# EAGLE design battery_powered_sensor (EAGLE 9.6.2)
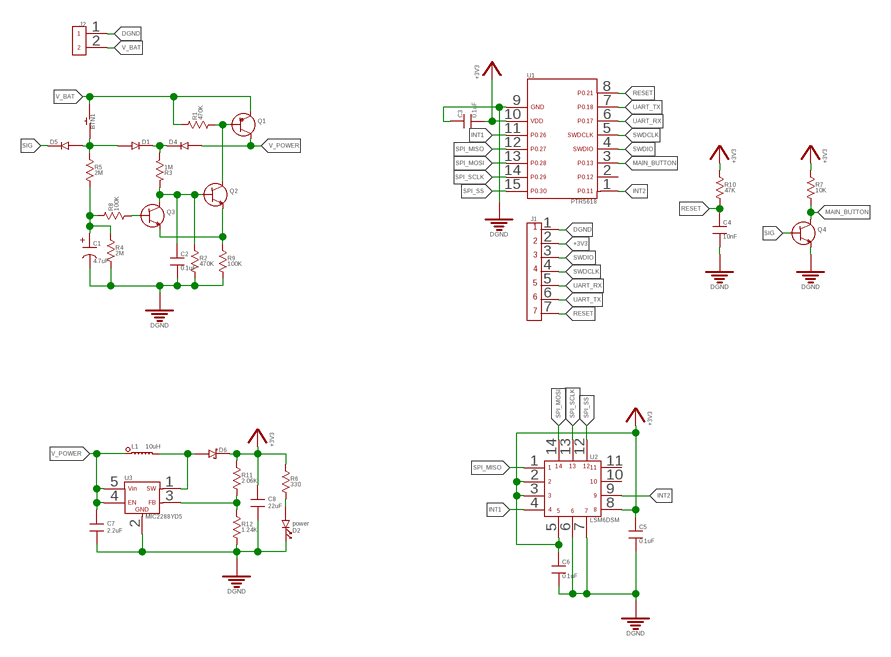
[diagram p0: schematic, sheet 1]

## Parts
BTN1  BTN_NORMAL_OFF_6_3.5_SMD  [BTN_6_3.5_SMD]
C1  4.7uF  CAPACITOR_POLARIZED_530_530  [CAP_530_530]
C2  0.1uF  CAPACITOR_FIXED_0805  [0805]
C3  0.1uF  CAPACITOR_FIXED_0805  [0805]
C4  10nF  CAPACITOR_FIXED_0805  [0805]
C5  0.1uF  CAPACITOR_FIXED_0805  [0805]
C6  0.1uF  CAPACITOR_FIXED_0805  [0805]
C7  2.2uF  CAPACITOR_FIXED_0805  [0805]
C8  22uF  CAPACITOR_FIXED_0805  [0805]
D1  DIODE0805  [0805DIODE]
D2  power  LED-0805  [0805DIODE]
D4  DIODE0805  [0805DIODE]
D5  DIODE0805  [0805DIODE]
D6  SCHOTTKY_DIODE_0805  [0805DIODE]
J1  7PIN_HEADER_PITCH2.54MM_TH  [7PIN_HEADER_PITCH2.54MM_TH]
J2  2PIN_HEADER_PITCH2.54MM_TH  [2PIN_HEADER_PITCH2.54MM_TH]
L1  10uH  INDUCTOR_1008  [1008]
Q1  MMBT4403  [SOT_23_3]
Q2  BC846  [SOT_23_3]
Q3  BC846  [SOT_23_3]
Q4  BC846  [SOT_23_3]
R1  470K  RESISTOR_0805  [0805]
R2  470K  RESISTOR_0805  [0805]
R3  1M  RESISTOR_0805  [0805]
R4  2M  RESISTOR_0805  [0805]
R5  2M  RESISTOR_0805  [0805]
R6  330  RESISTOR_0805  [0805]
R7  10K  RESISTOR_0805  [0805]
R8  100K  RESISTOR_0805  [0805]
R9  100K  RESISTOR_0805  [0805]
R10  47K  RESISTOR_0805  [0805]
R11  2.06K  RESISTOR_0805  [0805]
R12  1.24K  RESISTOR_0805  [0805]
U1  PTR5618  [PTR5618]
U2  LSM6DSM  [LGA-14L]
U3  MIC2288YD5  [SOT-23-5]

## Nets
+3V3: C3.2 C5.1 C6.1 C8.1 D6.1 J1.2 R6.1 R7.1 R10.1 R11.1 U1.10 U2.2 U2.3 U2.5 U2.8
DGND: C1.2 C2.2 C3.1 C4.2 C5.2 C6.2 C7.2 C8.2 D2.1(K) J1.1 J2.1 Q4.3(E) R2.2 R4.2 R9.2 R12.2 U1.9 U2.6 U2.7 U3.2(GND)
INT1: U1.11 U2.4
INT2: U1.1 U2.9
MAIN_BUTTON: Q4.2(C) R7.2 U1.3
N$1: D1.1 D4.1 R3.2
N$2: Q1.1(B) Q2.2(C) R1.2
N$3: Q2.3(E) Q3.3(E) R9.1
N$4: C2.1 Q2.1(B) Q3.2(C) R2.1 R3.1
N$5: D2.2(A) R6.2
N$6: C1.1 R4.1 R5.2 R8.1
N$9: Q3.1(B) R8.2
N$10: BTN1.1 D1.2 D5.2 R5.1
N$14: R11.2 R12.1 U3.3(FB)
N$28: D6.2 L1.2 U3.1(SW)
RESET: C4.1 J1.7 R10.2 U1.8
SIG: D5.1 Q4.1(B)
SPI_MISO: U1.12 U2.1
SPI_MOSI: U1.13 U2.14
SPI_SCLK: U1.14 U2.13
SPI_SS: U1.15 U2.12
SWDCLK: J1.4 U1.5
SWDIO: J1.3 U1.4
UART_RX: J1.5 U1.6
UART_TX: J1.6 U1.7
V_BAT: BTN1.2 J2.2 Q1.3(E) R1.1
V_POWER: C7.1 D4.2 L1.1 Q1.2(C) U3.4(EN) U3.5(VIN)
Unconnected: U1.2 U2.10 U2.11

## Library data of the parts
BTN1 = Switches:BTN_NORMAL_OFF
C1 = Capacitors:CAPACITOR_POLARIZED
C2-C8 = Capacitors:CAPACITOR_FIXED
D1 D4 D5 = Diodes:DIODE
D2 = LEDs:LED
D6 = Diodes:SCHOTTKY_DIODE
J1 = Connectors:7PIN
J2 = Connectors:2PIN
L1 = Inductors:INDUCTOR
Q1 = BJTs:MMBT4403
Q2-Q4 = BJTs:BC846
R1-R12 = Resistors:RESISTOR
U1 = MCUs:PTR5618
U2 = IMU:LSM6DSM
U3 = Power Supplies:MIC2288YD5

## Board
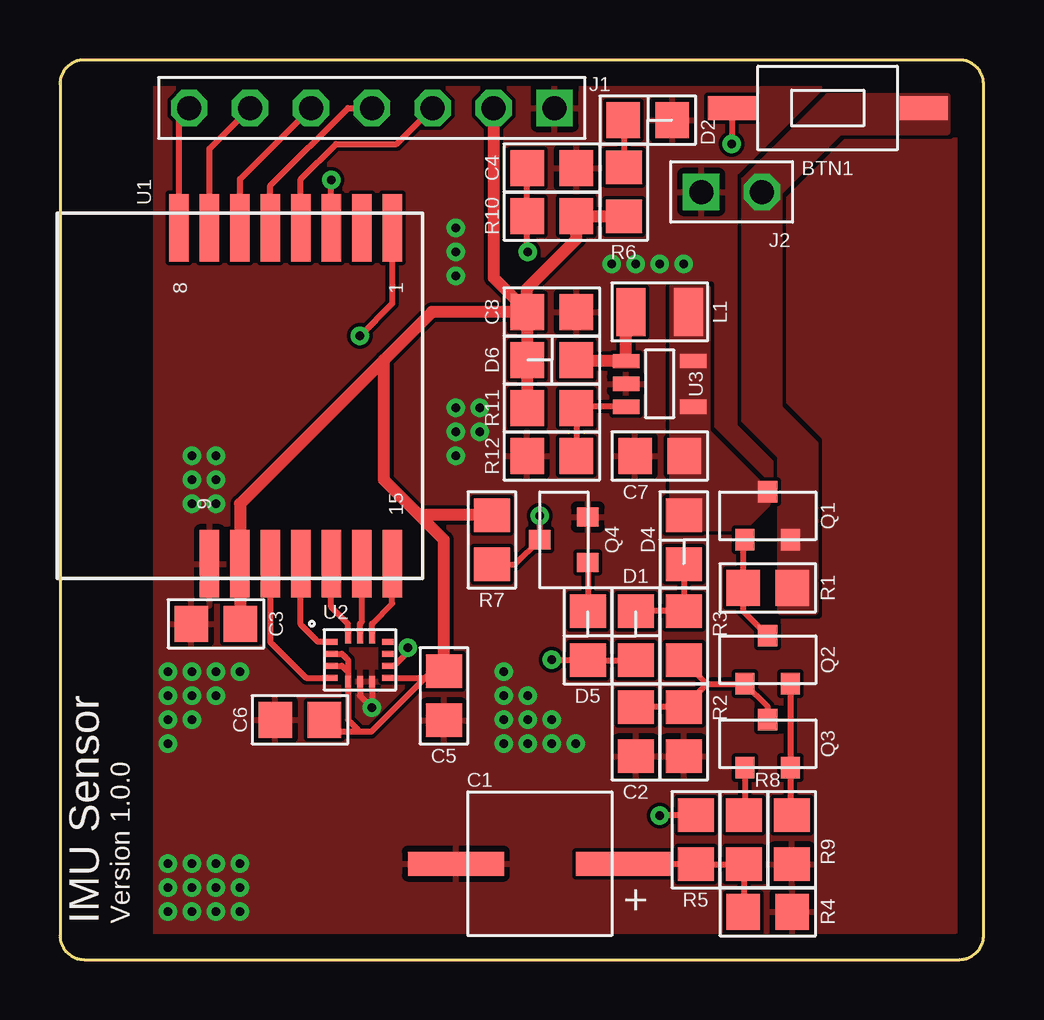
[diagram p1: board, top side]
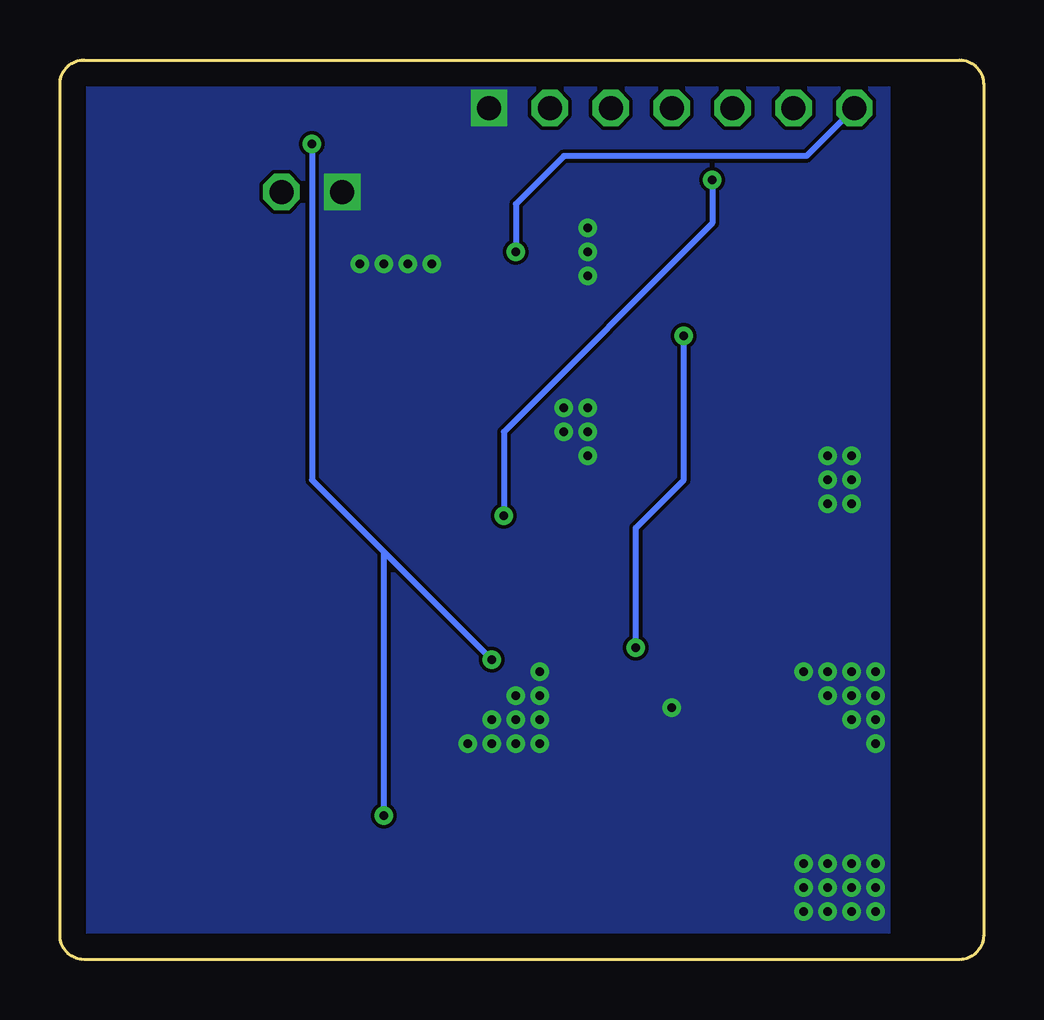
[diagram p2: board, bottom side, seen from below]

Size 38.5 x 37.5 mm. Coordinates in mm from the lower left corner, seen from the top.
Outline: 0,36.5 0,1 arc90 1,0 37.5,0 arc90 38.5,1 38.5,36.5 arc90 37.5,37.5 1,37.5 arc90 0,36.5
Copper layers (1*16): Top 0.035mm / dielectric 1.5mm / Bottom 0.035mm
Design rules "default *": minimum track width 6mil, minimum drill 0.35mm, track to track 6mil, track to pad 6mil, pad to pad 6mil, via to via 6mil, smd to smd 6mil, copper to edge 40mil, drill to drill 6mil, minimum pad ring 10mil, minimum via ring 8mil, stop-mask expansion 4mil, vias tented up to drill 20mil, thermal gap 10mil

### Footprints (pad centres in the part's own frame; a part is rotated, then mirrored left to right if it is on the bottom)
BTN_6_3.5_SMD = smd 1 x 2: 1 0,4; 2 0,-4
CAP_530_530 = smd 4 x 1: 1 -3.5,0; 2 3.5,0
0805 = smd 1.4 x 1.5: 1 -1.025,0; 2 1.025,0
0805DIODE = smd 1.4 x 1.5: 1 -1.025,0; 2 1.025,0
7PIN_HEADER_PITCH2.54MM_TH = drill 1 square: 1 -7.62,0 | drill 1 octagon: 2 -5.08,0; 3 -2.54,0; 4 0,0; 5 2.54,0; 6 5.08,0; 7 7.62,0
2PIN_HEADER_PITCH2.54MM_TH = drill 1 square: 1 -1.27,0 | drill 1 octagon: 2 1.27,0
1008 = smd 1.2 x 2: 1 -1.2,0; 2 1.2,0
SOT_23_3 = smd 0.8 x 0.9: 1 -0.95,0; 2 0,2; 3 0.95,0
PTR5618 = smd 2.794 x 0.813: 1 7,-6.35; 2 7,-5.08; 3 7,-3.81; 4 7,-2.54; 5 7,-1.27; 6 7,0; 7 7,1.27; 8 7,2.54; 9 -7,1.27; 10 -7,0; 11 -7,-1.27; 12 -7,-2.54; 13 -7,-3.81; 14 -7,-5.08; 15 -7,-6.35
LGA-14L = smd 0.475 x 0.25: 1 -1.163,0.75; 2 -1.163,0.25; 3 -1.163,-0.25; 4 -1.163,-0.75; 8 1.163,-0.75; 9 1.163,-0.25; 10 1.163,0.25; 11 1.163,0.75 | smd 0.25 x 0.475: 5 -0.5,-0.912; 6 0,-0.912; 7 0.5,-0.912; 12 0.5,0.912; 13 0,0.912; 14 -0.5,0.912
SOT-23-5 = smd 0.6 x 1.1: 1 -0.95,-1.4; 2 0,-1.4; 3 0.95,-1.4; 4 0.95,1.4; 5 -0.95,1.4

### Placement (x,y rotation side)
BTN1  32,35.5 90 top
C1  20,4 180 top
C2  24,9.5 270 top
C3  6.5,14 0 top
C4  20.5,33 0 top
C5  16,11 270 top
C6  10,10 180 top
C7  25,21 180 top
C8  20.5,27 0 top
D1  24,13.5 270 top
D2  24.5,35 180 top
D4  26,17.5 90 top
D5  22,13.5 270 top
D6  20.5,25 0 top
J1  13,35.5 180 top
J2  28,32 0 top
L1  25,27 180 top
Q1  29.5,17.5 0 top
Q2  29.5,11.5 0 top
Q3  29.5,8 0 top
Q4  22,17.5 90 top
R1  29.5,15.5 180 top
R2  26,9.5 270 top
R3  26,13.5 90 top
R4  29.5,2 0 top
R5  26.5,5 270 top
R6  23.5,32 90 top
R7  18,17.5 270 top
R8  28.5,5 90 top
R9  30.5,5 270 top
R10  20.5,31 180 top
R11  20.5,23 0 top
R12  20.5,21 180 top
U1  7.5,23.5 90 top
U2  12.5,12.5 0 top
U3  25,24 270 top

### Tracks (layer width: path | path; a pad name or v marks a point on that pad's centre or on a via)
+3V3
  Top 0.254: 7.5,14.03 C3.2 | U2.2 11.75,12.75 12,12.5 12,12 | 12,12 U2.5 12,10 12.49,9.51 12.47,9.5 | U2.3 11.75,12.25 12,12 | U2.8 15.22,11.75 | 15.22,11.75 12.97,9.5 12.47,9.5 | C6.1 11.53,9.5 12.47,9.5 | C5.1 15.5,12.03 15.22,11.75
  Top 0.508: C8.1 D6.1 R11.1 | C8.1 19.48,27.98 21.52,30.02 R10.1 21.55,30.98 R6.1 | J1.2 18.08,28.42 19.5,27 C8.1 | C8.1 15.5,27 13.5,25 | 13.5,25 7.5,19 U1.10 7.5,14.03 | C5.1 16,17.5 15,18.5 | 13.5,25 13.5,20 15,18.5 | R7.1 15.03,18.52 15,18.5
DGND  (via drill 0.35)
  Top 0.254: U2.7 v13,10.5 12.5,11 U2.6
  other vias: 4.5,12 5.5,12 6.5,12 5.5,11 4.5,11 4.5,10 4.5,9 5.5,10 6.5,11 7.5,12 4.5,2 5.5,2 6.5,2 7.5,2 7.5,3 6.5,3 5.5,3 4.5,3 4.5,4 5.5,4 6.5,4 7.5,4 18.5,11 18.5,10 18.5,9 19.5,9 20.5,9 19.5,10 16.5,21 16.5,22 16.5,23 17.5,23 17.5,22 16.5,28.5 16.5,29.5 16.5,30.5 23,29 24,29 25,29 5.5,19 5.5,20 6.5,20 6.5,19 6.5,21 5.5,21 18.5,12 19.5,11 20.5,10 21.5,9 26,29
  pour Top (rank 6): 4,36.5 37.5,36.5 37.5,1 4,1
  pour Bottom (rank 6, no thermals): 4,36.5 37.5,36.5 37.5,1 4,1
INT1
  Top 0.254: U1.11 8.77,13.23 10.25,11.75 U2.4
INT2  (via drill 0.35)
  Top 0.254: U1.1 13.85,27.35 v12.5,26 | v14.5,13 14.5,12.83 13.92,12.25 U2.9
  Bottom 0.254: v14.5,13 14.5,18 12.5,20 v12.5,26
MAIN_BUTTON  (via drill 0.35)
  Top 0.254: R7.2 18.98,16.48 Q4.2 v20,18.5 | U1.3 v11.31,32.5
  Bottom 0.254: v11.31,32.5 11.31,30.69 20,22 v20,18.5
N$1
  Top 0.254: D4.1 R3.2 D1.1
N$2
  Top 0.254: Q1.1 28.48,17.43 R1.2 28.48,14.53 Q2.2
N$3
  Top 0.254: Q2.3 Q3.3 30.45,6.08 R9.1
N$4
  Top 0.254: R3.1 26.98,11.5 | 26.98,11.5 Q2.1 29.5,10.55 Q3.2 | 26.98,11.5 R2.1 C2.1
N$5
  Top 0.254: D2.2 23.5,34.98 R6.2
N$6
  Top 0.254: C1.1 26.48,4 R5.2 R8.1 28.5,2.02 R4.1
N$9
  Top 0.254: Q3.1 28.55,6.08 R8.2
N$10  (via drill 0.35)
  Top 0.254: v20.5,12.5 21.98,12.5 D5.2 D1.2 | v25,6 25.02,6.03 R5.1 | BTN1.1 v28,34
  Bottom 0.254: v28,34 28,20 25,17 | 25,17 v20.5,12.5 | v25,6 25,17
N$14
  Top 0.254: U3.3 21.57,23.05 R11.2 R12.1
N$28
  Top 0.508: D6.2 21.57,24.95 U3.1 23.6,26.8 L1.2
RESET  (via drill 0.35)
  Top 0.254: U1.8 4.96,35.08 J1.7 | v19.5,29.5 19.48,29.52 R10.2 C4.1
  Bottom 0.254: J1.7 7.38,33.5 17.5,33.5 19.5,31.5 v19.5,29.5
SIG
  Top 0.254: Q4.1 D5.1
SPI_MISO
  Top 0.254: U2.1 10.75,13.25 10.04,13.96 U1.12
SPI_MOSI
  Top 0.254: U1.13 11.31,14.69 12,14 U2.14
SPI_SCLK
  Top 0.254: U2.13 12.5,14 12.58,14.08 U1.14
SPI_SS
  Top 0.254: U2.12 13,14 13.85,14.85 U1.15
SWDCLK
  Top 0.254: U1.5 8.77,32.27 12,35.5 J1.4
SWDIO
  Top 0.254: U1.4 10.04,32.54 11.5,34 14.04,34 J1.3
UART_RX
  Top 0.254: U1.6 7.5,32.54 J1.5
UART_TX
  Top 0.254: U1.7 6.23,33.81 J1.6
V_BAT
  pour Top (rank 2, no thermals): 37,36 32,36 28.5,32.5 28.5,22.5 30,21 30,14.5 31.5,14.5 31.5,21.5 30,23 30,32 32.5,34.5 37,34.5
V_POWER
  pour Top (no thermals): 25.5,28 25.5,18 28.5,18 29.5,19 29.5,19.5 27,22 27,28

### Text on the board
tPlace: IMU Sensor | Version 1.0.0